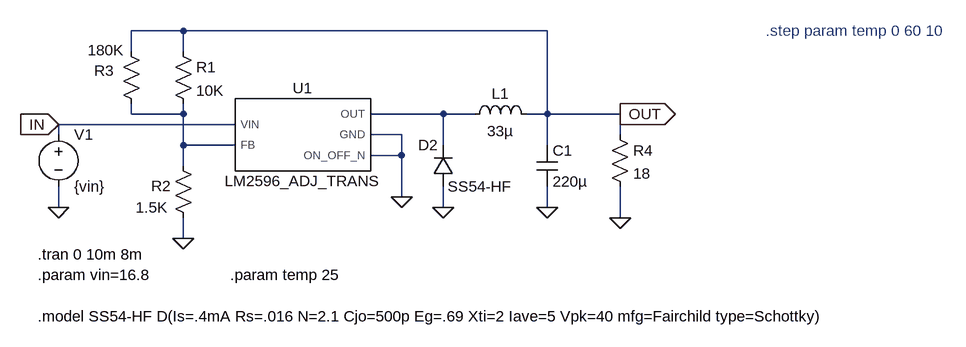
[diagram p0: schematic LM2596 - 5V.asc]
LM2596 - 5V.asc, the LTspice schematic file:
Version 4
SHEET 1 1244 680
WIRE 48 -16 -32 -16
WIRE 608 -16 48 -16
WIRE -32 16 -32 -16
WIRE 48 16 48 -16
WIRE -32 112 -32 96
WIRE 48 112 48 96
WIRE 48 112 -32 112
WIRE 448 112 336 112
WIRE 496 112 448 112
WIRE 608 112 608 -16
WIRE 608 112 576 112
WIRE 720 112 608 112
WIRE 128 128 -144 128
WIRE -144 144 -144 128
WIRE 384 144 336 144
WIRE 720 144 720 112
WIRE 48 160 48 112
WIRE 128 160 48 160
WIRE 448 160 448 112
WIRE 608 160 608 112
WIRE 384 176 384 144
WIRE 384 176 336 176
WIRE 48 192 48 160
WIRE 384 240 384 176
WIRE -144 256 -144 224
WIRE 448 256 448 224
WIRE 608 256 608 224
WIRE 720 272 720 224
WIRE 48 304 48 272
FLAG -144 256 0
FLAG 384 240 0
FLAG 448 256 0
FLAG 608 256 0
FLAG 48 304 0
FLAG 720 272 0
FLAG 720 112 OUT
IOPIN 720 112 Out
FLAG -144 128 IN
IOPIN -144 128 In
SYMBOL voltage -144 128 R0
WINDOW 123 0 0 Left 0
WINDOW 39 0 0 Left 0
SYMATTR InstName V1
SYMATTR Value {vin}
SYMBOL res 32 0 R0
SYMATTR InstName R1
SYMATTR Value 10K
SYMATTR SpiceLine tol=1
SYMBOL ind 480 128 R270
WINDOW 0 32 56 VTop 2
WINDOW 3 5 56 VBottom 2
SYMATTR InstName L1
SYMATTR Value 33µ
SYMATTR SpiceLine Rser=0.093
SYMBOL cap 592 160 R0
SYMATTR InstName C1
SYMATTR Value 220µ
SYMBOL res 32 176 R0
WINDOW 0 -33 47 Left 2
WINDOW 3 -57 80 Left 2
SYMATTR InstName R2
SYMATTR Value 1.5K
SYMATTR SpiceLine tol=1
SYMBOL res -48 0 R0
WINDOW 0 -41 45 Left 2
WINDOW 3 -51 14 Left 2
SYMATTR InstName R3
SYMATTR Value 180K
SYMATTR SpiceLine tol=1
SYMBOL res 704 128 R0
SYMATTR InstName R4
SYMATTR Value 18
SYMATTR SpiceLine tol=1
SYMBOL AutoGenerated\\LM2596_ADJ_TRANS 224 144 R0
SYMATTR InstName U1
SYMATTR Value LM2596_ADJ_TRANS
SYMBOL diode 464 224 R180
WINDOW 0 24 64 Left 2
WINDOW 3 -90 0 Left 2
SYMATTR InstName D2
SYMATTR Value SS54-HF
TEXT -176 328 Left 2 !.tran 0 10m 8m
TEXT -176 424 Left 2 !.model SS54-HF D(Is=.4mA Rs=.016 N=2.1 Cjo=500p Eg=.69 Xti=2 Iave=5 Vpk=40 mfg=Fairchild type=Schottky)
TEXT -176 360 Left 2 !.param vin=16.8
TEXT 120 360 Left 2 !.param temp 25
TEXT 944 -16 Left 2 ;.step param temp 0 60 10

The netlist it stands for:
* LM2596 - 5V.asc
V1 IN 0 {vin}
R1 OUT N001 10K tol=1
L1 N002 OUT 33µ Rser=0.093
C1 OUT 0 220µ
R2 N001 0 1.5K tol=1
R3 OUT N001 180K tol=1
R4 OUT 0 18 tol=1
XU1 IN N001 N002 0 0 LM2596_ADJ_TRANS  ; pins VIN FB OUT GND ON_OFF_N
D2 0 N002 SS54-HF
.model D D
.lib standard.dio
.tran 0 10m 8m
.model SS54-HF D(Is=.4mA Rs=.016 N=2.1 Cjo=500p Eg=.69 Xti=2 Iave=5 Vpk=40 mfg=Fairchild type=Schottky)
.param vin=16.8
.param temp 25
* .step param temp 0 60 10
.lib C:\Users\gabri\Google Drive\ESP32\SIMULATIONS\MODELS\LM2596_ADJ_TRANS.LIB
.backanno
.end